# Altium schematic sheet jsduino.SchDoc
size A4
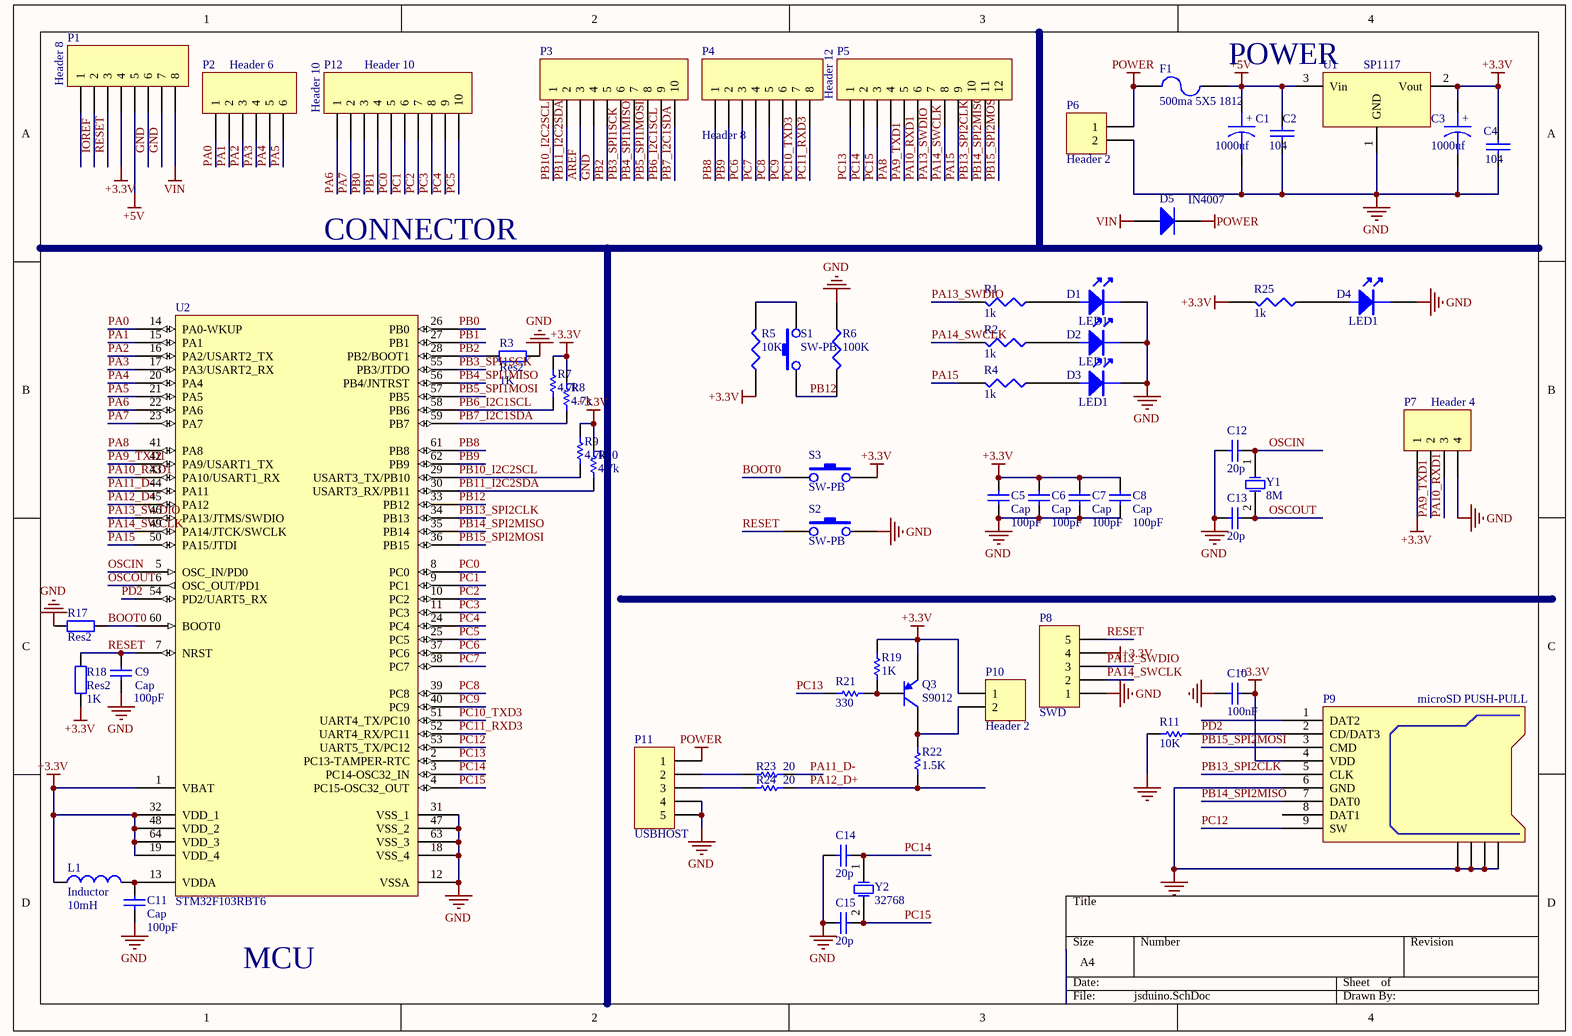
[diagram p0: jsduino.SchDoc]

## Parts
C1  1000uf  [c6.3*5.3]
C2  104  [0603CC]
C3  104  [0603CC]
C4  1000uf  [c6.3*5.3]
C5  Cap  value 100pF  [0603CC]
C6  Cap  value 100pF  [0603CC]
C7  Cap  value 100pF  [0603CC]
C8  Cap  value 100pF  [0603CC]
C9  Cap  value 100pF  [0603CC]
C10  100nF  [0603CC]
C11  Cap  value 100pF  [0603CC]
C12  value 20p  [0603CC]  (hidden comment: Cap)
C13  value 20p  [0603CC]  (hidden comment: Cap)
C14  value 20p  [0603CC]  (hidden comment: Cap)
C15  value 20p  [0603CC]  (hidden comment: Cap)
D1  LED1  [0805LED]
D2  LED1  [0805LED]
D3  LED1  [0805LED]
D4  LED1  [0805LED]
D5  IN4007  [DIODE_SS14]
F1  500ma 5X5 1812  [1812R]
L1  Inductor  value 10mH  [0603RR]
P1  Header 8  [HDR1X8]
P2  Header 6  [HDR1X6]
P3  Header 10  [HDR1X10]
P4  Header 8  [HDR1X8]
P5  Header 12  [HDR1X12]
P6  Header 2  [5VINPUT]
P7  Header 4  [HDR1X4]
P8  SWD  [HDR1X5]
P9  microSD PUSH-PULL  [microSD-1]
P10  Header 2  [HDR1X2]
P11  USBHOST  [USB_mini]
P12  Header 10  [HDR1X10]
Q3  S9012  [SOT-23]
R1  1k  [0603RR]
R2  1k  [0603RR]
R3  Res2  value 1K  [0603RR]
R4  1k  [0603RR]
R5  10K  [0603RR]
R6  100K  [0603RR]
R7  value 4.7k  [0603RR]  (hidden comment: Res Semi)
R8  value 4.7k  [0603RR]  (hidden comment: Res Semi)
R9  value 4.7k  [0603RR]  (hidden comment: Res Semi)
R10  value 4.7k  [0603RR]  (hidden comment: Res Semi)
R11  value 10K  [0603RR]  (hidden comment: Res Semi)
R17  Res2  [0603RR]
R18  Res2  value 1K  [0603RR]
R19  value 1K  [0603RR]  (hidden comment: Res Semi)
R21  value 330  [0603RR]  (hidden comment: Res Semi)
R22  value 1.5K  [0603RR]  (hidden comment: Res Semi)
R23  value 20  [0603RR]  (hidden comment: Res Semi)
R24  value 20  [0603RR]  (hidden comment: Res Semi)
R25  1k  [0603RR]
S1  SW-PB  [KEY_5*5*X]
S2  SW-PB  [KEY_5*5*X]
S3  SW-PB  [KEY_5*5*X]
U1  SP1117  [SOT-223]
U2  STM32F103RBT6  [LQFP64_M]
Y1  8M  [XTAL_smd1]
Y2  32768  [XTAL_32768_HH]

## Nets
+3.3V: C3.1 C4.1 C5.2 C6.2 C7.2 C8.2 C10.2 L1.1 P1.4 P7.1 P8.4 P9.4(VDD) P10.1 Q3.2(E) R5.1 R7.1 R8.1 R9.1 R10.1 R18.1 R19.2 R25.2 S3.2 U1.2(Vout) U2.1(VBAT) U2.19(VDD_4) U2.32(VDD_1) U2.48(VDD_2) U2.64(VDD_3)
+5V: C1.1 C2.1 F1.2 P1.5 U1.3(Vin)
GND: C1.2 C2.2 C3.2 C4.2 C5.1 C6.1 C7.1 C8.1 C9.1 C10.1 C11.1 C12.2 C13.2 C14.2 C15.2 D1.2 D2.2 D3.2 D4.2 P1.6 P1.7 P3.4 P6.2 P7.4 P8.1 P9.6(GND) P9.GP1 P9.GP2 P9.GP3 P9.GP4 P11.4 P11.5 R3.1 R6.1 R11.2 R17.2 S2.2 U1.1(GND) U2.12(VSSA) U2.18(VSS_4) U2.31(VSS_1) U2.47(VSS_2) U2.63(VSS_3)
POWER: D5.2(K) F1.1 P6.1 P11.1
VIN: D5.1(A) P1.8
AREF: P3.3
BOOT0: R17.1 S3.1 U2.60(BOOT0)
IOREF: P1.2
OSCIN: C12.1 U2.5(OSC_IN/PD0) Y1.1(OSC1)
OSCOUT: C13.1 U2.6(OSC_OUT/PD1) Y1.2(OSC2)
PA0: P2.1 U2.14(PA0-WKUP)
PA1: P2.2 U2.15(PA1)
PA2: P2.3 U2.16(PA2/USART2_TX)
PA3: P2.4 U2.17(PA3/USART2_RX)
PA4: P2.5 U2.20(PA4)
PA5: P2.6 U2.21(PA5)
PA6: P12.1 U2.22(PA6)
PA7: P12.2 U2.23(PA7)
PA8: P5.4 U2.41(PA8)
PA9_TXD1: P5.5 P7.2 U2.42(PA9/USART1_TX)
PA10_RXD1: P5.6 P7.3 U2.43(PA10/USART1_RX)
PA11_D-: R23.2 U2.44(PA11)
PA12_D+: R22.2 R24.2 U2.45(PA12)
PA13_SWDIO: P5.7 P8.3 R1.2 U2.46(PA13/JTMS/SWDIO)
PA14_SWCLK: P5.8 P8.2 R2.2 U2.49(PA14/JTCK/SWCLK)
PA15: P5.9 R4.2 U2.50(PA15/JTDI)
PB0: P12.3 U2.26(PB0)
PB1: P12.4 U2.27(PB1)
PB2: P3.5 R3.2 U2.28(PB2/BOOT1)
PB3_SPI1SCK: P3.6 U2.55(PB3/JTDO)
PB4_SPI1MISO: P3.7 U2.56(PB4/JNTRST)
PB5_SPI1MOSI: P3.8 U2.57(PB5)
PB6_I2C1SCL: P3.9 R7.2 U2.58(PB6)
PB7_I2C1SDA: P3.10 R8.2 U2.59(PB7)
PB8: P4.1 U2.61(PB8)
PB9: P4.2 U2.62(PB9)
PB10_I2C2SCL: P3.1 R9.2 U2.29(USART3_TX/PB10)
PB11_I2C2SDA: P3.2 R10.2 U2.30(USART3_RX/PB11)
PB12: R6.2 S1.1 U2.33(PB12)
PB13_SPI2CLK: P5.10 P9.5(CLK) U2.34(PB13)
PB14_SPI2MISO: P5.11 P9.7(DAT0) U2.35(PB14)
PB15_SPI2MOSI: P5.12 P9.3(CMD) U2.36(PB15)
PC0: P12.5 U2.8(PC0)
PC1: P12.6 U2.9(PC1)
PC2: P12.7 U2.10(PC2)
PC3: P12.8 U2.11(PC3)
PC4: P12.9 U2.24(PC4)
PC5: P12.10 U2.25(PC5)
PC6: P4.3 U2.37(PC6)
PC7: P4.4 U2.38(PC7)
PC8: P4.5 U2.39(PC8)
PC9: P4.6 U2.40(PC9)
PC10_TXD3: P4.7 U2.51(UART4_TX/PC10)
PC11_RXD3: P4.8 U2.52(UART4_RX/PC11)
PC12: P9.9(SW) U2.53(UART5_TX/PC12)
PC13: P5.1 R21.1 U2.2(PC13-TAMPER-RTC)
PC14: C14.1 P5.2 U2.3(PC14-OSC32_IN) Y2.1(OSC1)
PC15: C15.1 P5.3 U2.4(PC15-OSC32_OUT) Y2.2(OSC2)
PD2: P9.2(CD/DAT3) R11.1 U2.54(PD2/UART5_RX)
RESET: C9.2 P1.3 P8.5 R18.2 S2.1 U2.7(NRST)
NetC11_2: C11.2 L1.2 U2.13(VDDA)
NetD1_1: D1.1 R1.1
NetD2_1: D2.1 R2.1
NetD3_1: D3.1 R4.1
NetD4_1: D4.1 R25.1
NetP10_2: P10.2 Q3.3(C) R22.1
NetP11_2: P11.2 R23.1
NetP11_3: P11.3 R24.1
NetQ3_1: Q3.1(B) R19.1 R21.2
NetR5_2: R5.2 S1.2

Not connected (* = marked no-connect by the designer): P1 1; P9 1(DAT2) 8(DAT1)

## Notes on the sheet
- POWER
- CONNECTOR
- MCU
- (in symbol CAPACITOR POL) +

## Library data of the parts
C1 C4 = CAPACITOR POL: Capacitor
C2 C3 = CAP: Capacitor
C5-C9 C11-C15 = Cap: Capacitor; Published: 8-Jun-2000; LatestRevisionDate: 17-Jul-2002; LatestRevisionNote: Re-released for DXP Platform.; PackageReference: RAD-0.3; Publisher: Altium Limited
  C5-C9 C11: PackageDescription: Radial Cap, Thru-Hole; 2 Leads; 0.3 in Pin Spacing
C10 = CAP
D1-D4 = LED
D5 = Diode: Default Diode; Published: 8-Jun-2000; LatestRevisionDate: 17-Jul-2002; LatestRevisionNote: Re-released for DXP Platform.; PackageVersion: Sep-1996; PackageReference: SMC; Publisher: Altium Limited; PackageDescription: DO-214-AB/SMC; 2 C-Bend Leads; Body 7.9 x 5.9 mm, inc. leads (LxW); Code_JEDEC: DO-214-AB
F1 = Fuse 2: Fuse; Published: 8-Jun-2000; LatestRevisionDate: 17-Jul-2002; LatestRevisionNote: Re-released for DXP Platform.; PackageReference: PIN-W2/E2.8; Publisher: Altium Limited; PackageDescription: Thru-Hole; 2 Leads
L1 = Inductor: Code_IEC: 1005; Published: 8-Jun-2000; LatestRevisionDate: 29-May-2009; LatestRevisionNote: IPC-7351 Footprint Added.; PackageReference: 0402-A; Publisher: Altium Limited; PackageDescription: Chip Inductor; Code_JEITA: 0402
P1 P4 = Header 8: Header, 8-Pin; LatestRevisionDate: 17-Jul-2002; LatestRevisionNote: Re-released for DXP Platform.; Publisher: Altium Limited
P2 = Header 6: Header, 6-Pin; LatestRevisionDate: 17-Jul-2002; LatestRevisionNote: Re-released for DXP Platform.; Publisher: Altium Limited
P3 P12 = Header 10: Header, 10-Pin; LatestRevisionDate: 17-Jul-2002; LatestRevisionNote: Re-released for DXP Platform.; Publisher: Altium Limited
P5 = Header 12: Header, 12-Pin; LatestRevisionDate: 17-Jul-2002; LatestRevisionNote: Re-released for DXP Platform.; Publisher: Altium Limited
P6 P10 = Header 2: Header, 2-Pin; LatestRevisionDate: 17-Jul-2002; LatestRevisionNote: Re-released for DXP Platform.; Publisher: Altium Limited
P7 = Header 4: Header, 4-Pin; LatestRevisionDate: 17-Jul-2002; LatestRevisionNote: Re-released for DXP Platform.; Publisher: Altium Limited
P8 P11 = Header 5: Header, 5-Pin; LatestRevisionDate: 17-Jul-2002; LatestRevisionNote: Re-released for DXP Platform.; Publisher: Altium Limited
Q3 = S9012: PNP General Purpose Amplifier; Published: 8-Jun-2000; LatestRevisionDate: 15-Jan-2003; LatestRevisionNote: PCB Footprint 'BCY-W3/D4.7' replaced; DatasheetVersion: 1997; PackageVersion: Sep-1998; PackageReference: TO-92A; Publisher: Altium Limited; PackageDescription: TO, Flat Index; 3 In-Line, Axial Leads; Body Dia. 4.5mm; Leads 0.51 x 0.48 mm (max); ComponentLink1Description: Manufacturer Link; ComponentLink1URL: http://www.fairchildsemi.com/; ComponentLink2Description: Datasheet; ComponentLink2URL: http://www.fairchildsemi.com/ds/2N%2F2N3906.pdf
R1 R2 R4-R6 R25 = RES1
R3 R17 R18 = Res2: Resistor; Published: 8-Jun-2000; LatestRevisionDate: 17-Jul-2002; LatestRevisionNote: Re-released for DXP Platform.; PackageReference: AXIAL-0.4; Publisher: Altium Limited; PackageDescription: Axial Device, Thru-Hole; 2 Leads; 0.4 in Pin Spacing
R7-R11 R19 R21-R24 = Res Semi: Semiconductor Resistor; Published: 8-Jun-2000; LatestRevisionDate: 17-Jul-2002; LatestRevisionNote: Re-released for DXP Platform.; PackageReference: AXIAL-0.5; Publisher: Altium Limited; PackageDescription: Axial Device, Thru-Hole; 2 Leads; 0.5 in Pin Spacing
U2 = STM32F103RBT6: STM32 ARM-based 32-bit MCU with 128 Kbytes Flash, 64-pin LQFP, Industrial Temperature; Published: *; DatasheetVersion: *; PackageVersion: *; PackageReference: *; Publisher: *; PackageDescription: *; ComponentLink1Description: *; ComponentLink1URL: *; ComponentLink2Description: *; ComponentLink2URL: *
Y1 Y2 = XTAL: Crystal Oscillator; Published: 8-Jun-2000; LatestRevisionDate: 17-Jul-2002; LatestRevisionNote: Re-released for DXP Platform.; Publisher: Altium Limited